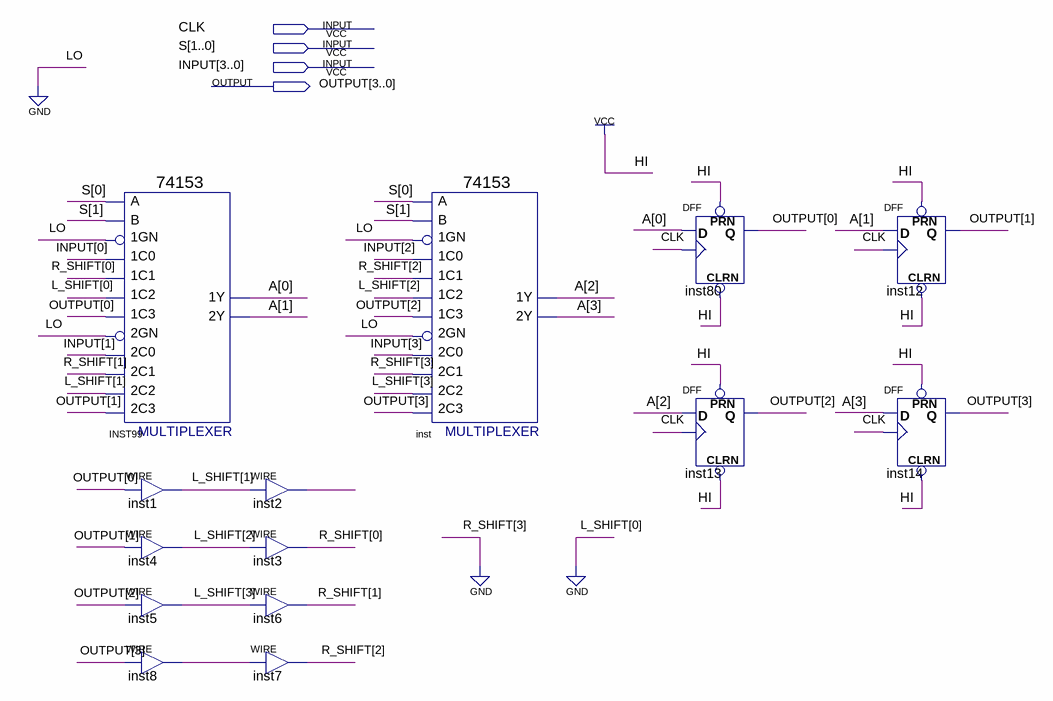
[diagram p0: schematic sheet]
// Quartus schematic quiz4_shifter.bdf as structural Verilog: 14 symbols, 4 pins
module quiz4_shifter (
  input  CLK,
  input  [1:0] S,
  input  [3:0] INPUT,
  output [3:0] OUTPUT
);

  wire inst2_out, inst8_out;
  wire [2:0] R_SHIFT;
  wire [3:0] A;
  wire [3:1] L_SHIFT;

  \74153  INST99 (
    .\1C1 (R_SHIFT[0]), .\1GN (1'b0), .\1C0 (INPUT[0]), .\2C0 (INPUT[1]), .\2GN (1'b0), .\2C2 (L_SHIFT[1]),
    .\1C2 (1'b0), .\1C3 (OUTPUT[0]), .B(S[1]), .A(S[0]), .\2C1 (R_SHIFT[1]), .\2C3 (OUTPUT[1]), .\1Y (A[0]),
    .\2Y (A[1]));
  assign L_SHIFT[1] = OUTPUT[0];  // WIRE inst1
  assign L_SHIFT[2] = OUTPUT[1];  // WIRE inst4
  assign L_SHIFT[3] = OUTPUT[2];  // WIRE inst5
  assign inst8_out = OUTPUT[3];  // WIRE inst8
  assign inst2_out = L_SHIFT[1];  // WIRE inst2
  assign R_SHIFT[0] = L_SHIFT[2];  // WIRE inst3
  assign R_SHIFT[1] = L_SHIFT[3];  // WIRE inst6
  assign R_SHIFT[2] = inst8_out;  // WIRE inst7
  \74153  inst (
    .\1C1 (R_SHIFT[2]), .\1GN (1'b0), .\1C0 (INPUT[2]), .\2C0 (INPUT[3]), .\2GN (1'b0), .\2C2 (L_SHIFT[3]),
    .\1C2 (L_SHIFT[2]), .\1C3 (OUTPUT[2]), .B(S[1]), .A(S[0]), .\2C1 (1'b0), .\2C3 (OUTPUT[3]), .\1Y (A[2]),
    .\2Y (A[3]));
  DFF inst80 (.CLRN(1'b1), .CLK(CLK), .D(A[0]), .PRN(1'b1), .Q(OUTPUT[0]));
  DFF inst13 (.CLRN(1'b1), .CLK(CLK), .D(A[2]), .PRN(1'b1), .Q(OUTPUT[2]));
  DFF inst12 (.CLRN(1'b1), .CLK(CLK), .D(A[1]), .PRN(1'b1), .Q(OUTPUT[1]));
  DFF inst14 (.CLRN(1'b1), .CLK(CLK), .D(A[3]), .PRN(1'b1), .Q(OUTPUT[3]));
endmodule
